# Altium schematic sheet Communications.SchDoc
size A4
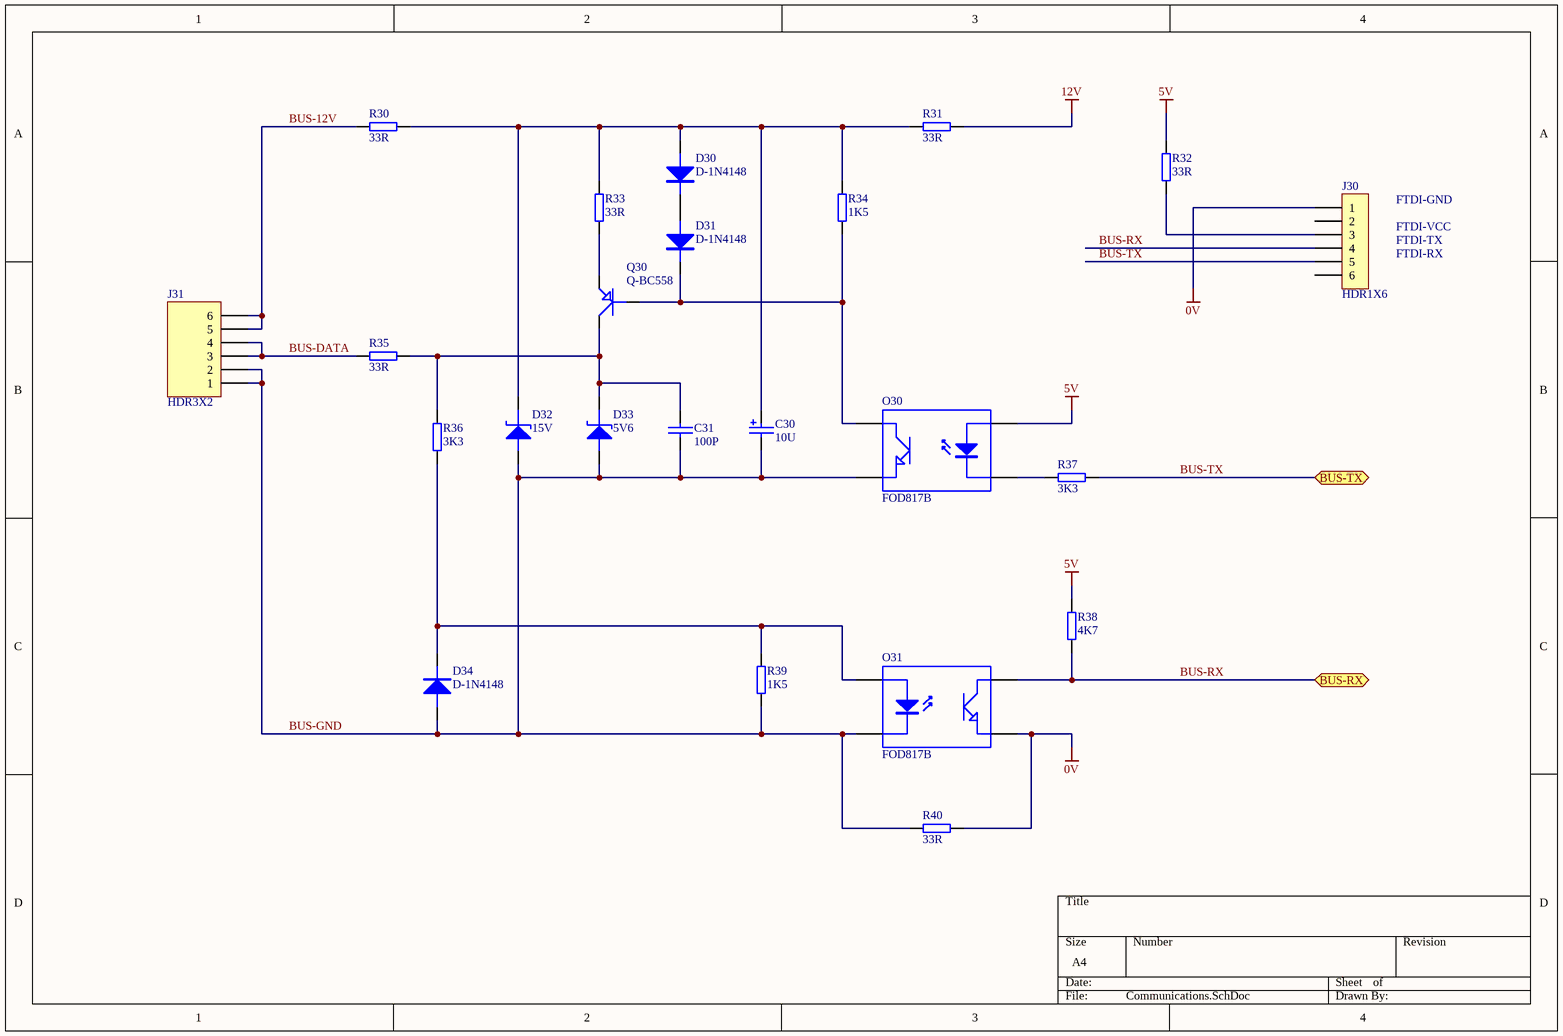
[diagram p0: Communications.SchDoc]

## Parts
C30  10U  [RADIAL02P]
C31  100P  [AXIAL02]
D30  D-1N4148  [DO35S]
D31  D-1N4148  [DO35S]
D32  15V  [DO35S]
D33  5V6  [DO35S]
D34  D-1N4148  [DO35S]
J30  HDR1X6  [HDR6X1]
J31  HDR3X2  [HDR3X2]
O30  FOD817B  [DIP4]
O31  FOD817B  [DIP4]
Q30  Q-BC558  [TO92]
R30  33R  [AXIAL04]
R31  33R  [AXIAL04]
R32  33R  [AXIAL04]
R33  33R  [AXIAL04]
R34  1K5  [AXIAL04]
R35  33R  [AXIAL04]
R36  3K3  [AXIAL04]
R37  3K3  [AXIAL04]
R38  4K7  [AXIAL04]
R39  1K5  [AXIAL04]
R40  33R  [AXIAL04]

## Ports
BUS-RX, BUS-TX

## Nets
0V: J30.1 O31.3(E) R40.2
5V: O30.1(A) R32.2 R38.2
12V: R31.2
BUS-12V: J31.5 J31.6 R30.1
BUS-DATA: J31.3 J31.4 R35.1
BUS-GND: C30.2 C31.2 D32.1(A) D33.1(A) D34.1(A) J31.1 J31.2 O30.3(E) O31.2(K) R39.1 R40.1
BUS-RX: J30.4 O31.4(C) R38.1 ; port BUS-RX
BUS-TX: J30.5 R37.1 ; port BUS-TX
NetC30_1: C30.1 D30.1(A) D32.2(K) R30.2 R31.1 R33.2 R34.2
NetC31_1: C31.1 D33.2(K) Q30.3(C) R35.2 R36.2
NetD30_2: D30.2(K) D31.1(A)
NetD31_2: D31.2(K) O30.4(C) Q30.2(B) R34.1
NetD34_2: D34.2(K) O31.1(A) R36.1 R39.2
NetJ30_3: J30.3 R32.1
NetO30_2: O30.2(K) R37.2
NetQ30_1: Q30.1(E) R33.1

Not connected (* = marked no-connect by the designer): J30 2 6

## Notes on the sheet
- FTDI-TX
- FTDI-GND
- FTDI-VCC
- FTDI-RX

## Library data of the parts
C30 = C-A10U: CAP
C31 = C-B100P: CAPACITOR
D30 D31 D34 = D-1N4148: 1N4148
D32 = D-BZX79-15: ZENER DIODE
D33 = D-BZX79-5V6: ZENER DIODE
J30 = J-HDR1X6: CONNECTOR; Text Field1: 6 PIN 2.54MM PITCH SINGLE
J31 = J-HDR3X2A: CONNECTOR
O30 O31 = O-FOD817B: OPTO ISOLATOR
Q30 = Q-BC558: BC558
R30-R33 R35 R40 = R-A33R: RESISTOR; Detail: *; Order: *; Cost: *
R34 R39 = R-A1K5: RESISTOR; Detail: *; Order: *; Cost: *
R36 R37 = R-A3K3: RESISTOR; Detail: *; Order: *; Cost: *
R38 = R-A4K7: RESISTOR; Detail: *; Order: *; Cost: *